# Altium schematic sheet Jumper Matrix.SchDoc: Power Load Jumper Matrix
size Letter; SheetNumber: 9; SheetTotal: 18
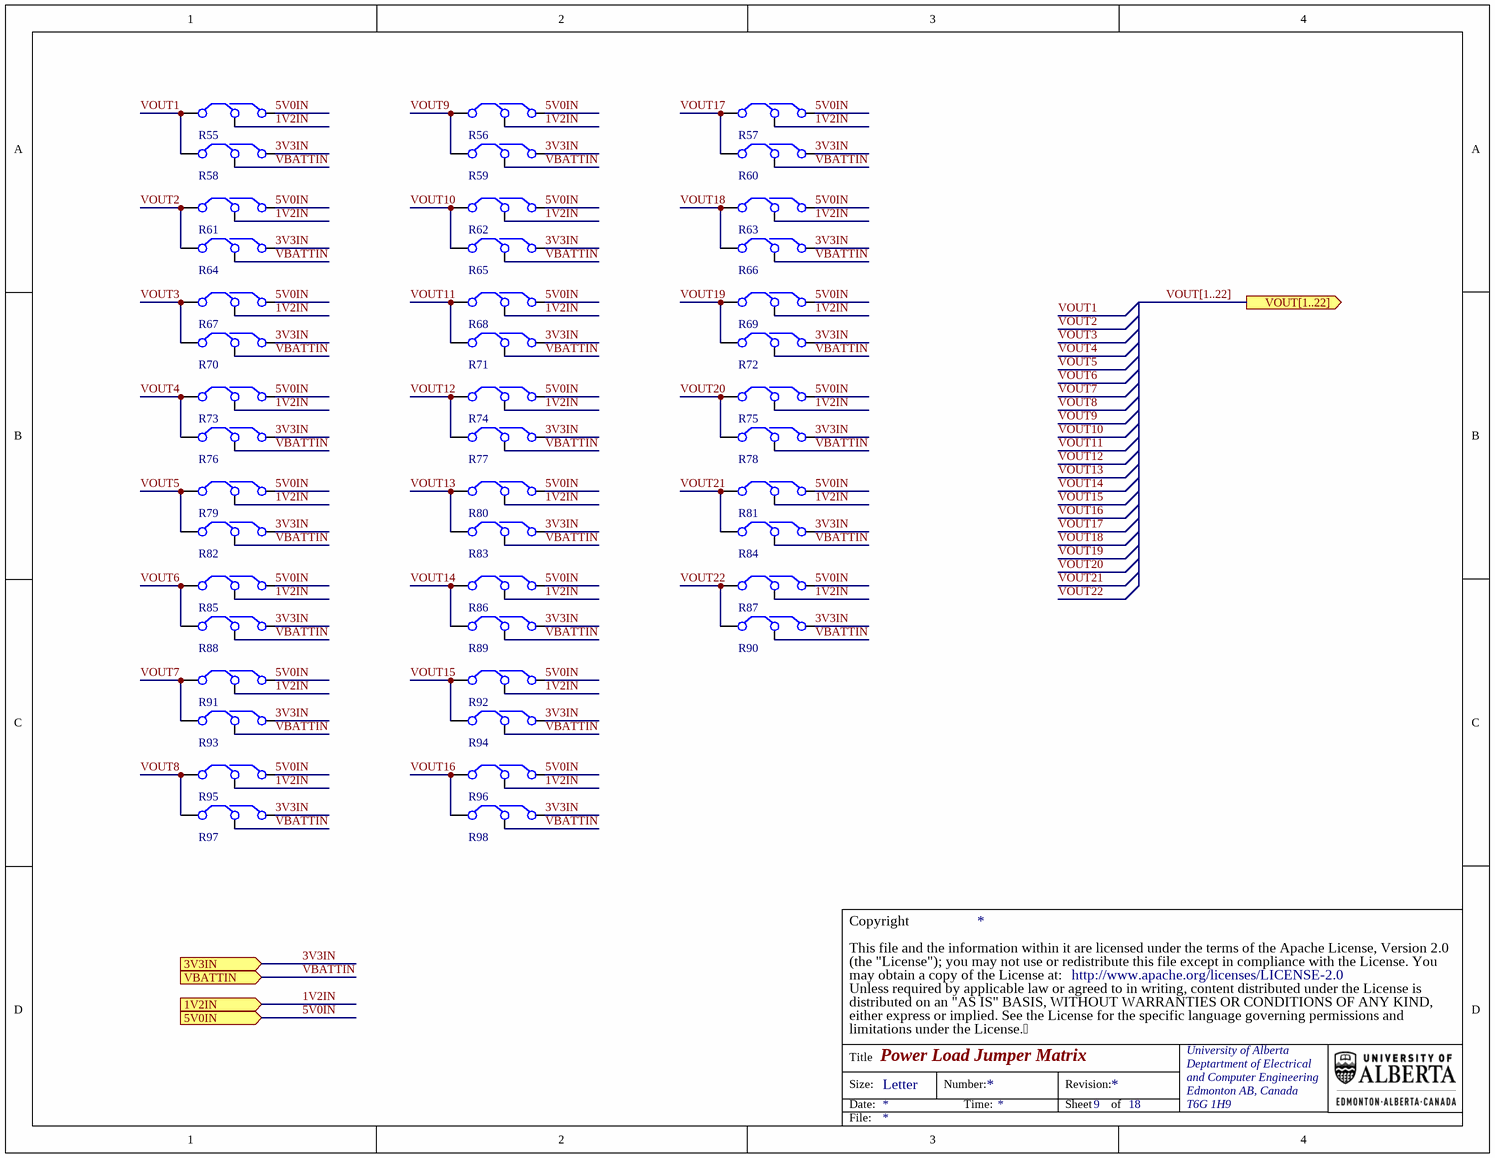
[diagram p0: Jumper Matrix.SchDoc]

## Parts
R55  Jumper  [VSH-RCZ1005orRCZ0505]  (value not drawn)
R56  Jumper  [VSH-RCZ1005orRCZ0505]  (value not drawn)
R57  Jumper  [VSH-RCZ1005orRCZ0505]  (value not drawn)
R58  Jumper  [VSH-RCZ1005orRCZ0505]  (value not drawn)
R59  Jumper  [VSH-RCZ1005orRCZ0505]  (value not drawn)
R60  Jumper  [VSH-RCZ1005orRCZ0505]  (value not drawn)
R61  Jumper  [VSH-RCZ1005orRCZ0505]  (value not drawn)
R62  Jumper  [VSH-RCZ1005orRCZ0505]  (value not drawn)
R63  Jumper  [VSH-RCZ1005orRCZ0505]  (value not drawn)
R64  Jumper  [VSH-RCZ1005orRCZ0505]  (value not drawn)
R65  Jumper  [VSH-RCZ1005orRCZ0505]  (value not drawn)
R66  Jumper  [VSH-RCZ1005orRCZ0505]  (value not drawn)
R67  Jumper  [VSH-RCZ1005orRCZ0505]  (value not drawn)
R68  Jumper  [VSH-RCZ1005orRCZ0505]  (value not drawn)
R69  Jumper  [VSH-RCZ1005orRCZ0505]  (value not drawn)
R70  Jumper  [VSH-RCZ1005orRCZ0505]  (value not drawn)
R71  Jumper  [VSH-RCZ1005orRCZ0505]  (value not drawn)
R72  Jumper  [VSH-RCZ1005orRCZ0505]  (value not drawn)
R73  Jumper  [VSH-RCZ1005orRCZ0505]  (value not drawn)
R74  Jumper  [VSH-RCZ1005orRCZ0505]  (value not drawn)
R75  Jumper  [VSH-RCZ1005orRCZ0505]  (value not drawn)
R76  Jumper  [VSH-RCZ1005orRCZ0505]  (value not drawn)
R77  Jumper  [VSH-RCZ1005orRCZ0505]  (value not drawn)
R78  Jumper  [VSH-RCZ1005orRCZ0505]  (value not drawn)
R79  Jumper  [VSH-RCZ1005orRCZ0505]  (value not drawn)
R80  Jumper  [VSH-RCZ1005orRCZ0505]  (value not drawn)
R81  Jumper  [VSH-RCZ1005orRCZ0505]  (value not drawn)
R82  Jumper  [VSH-RCZ1005orRCZ0505]  (value not drawn)
R83  Jumper  [VSH-RCZ1005orRCZ0505]  (value not drawn)
R84  Jumper  [VSH-RCZ1005orRCZ0505]  (value not drawn)
R85  Jumper  [VSH-RCZ1005orRCZ0505]  (value not drawn)
R86  Jumper  [VSH-RCZ1005orRCZ0505]  (value not drawn)
R87  Jumper  [VSH-RCZ1005orRCZ0505]  (value not drawn)
R88  Jumper  [VSH-RCZ1005orRCZ0505]  (value not drawn)
R89  Jumper  [VSH-RCZ1005orRCZ0505]  (value not drawn)
R90  Jumper  [VSH-RCZ1005orRCZ0505]  (value not drawn)
R91  Jumper  [VSH-RCZ1005orRCZ0505]  (value not drawn)
R92  Jumper  [VSH-RCZ1005orRCZ0505]  (value not drawn)
R93  Jumper  [VSH-RCZ1005orRCZ0505]  (value not drawn)
R94  Jumper  [VSH-RCZ1005orRCZ0505]  (value not drawn)
R95  Jumper  [VSH-RCZ1005orRCZ0505]  (value not drawn)
R96  Jumper  [VSH-RCZ1005orRCZ0505]  (value not drawn)
R97  Jumper  [VSH-RCZ1005orRCZ0505]  (value not drawn)
R98  Jumper  [VSH-RCZ1005orRCZ0505]  (value not drawn)

## Ports
1V2IN (in), 3V3IN (in), 5V0IN (in), VBATTIN (in), VOUT[1..22] (out)

## Nets
1V2IN: R55.2 R56.2 R57.2 R61.2 R62.2 R63.2 R67.2 R68.2 R69.2 R73.2 R74.2 R75.2 R79.2 R80.2 R81.2 R85.2 R86.2 R87.2 R91.2 R92.2 R95.2 R96.2 ; port 1V2IN
3V3IN: R58.3 R59.3 R60.3 R64.3 R65.3 R66.3 R70.3 R71.3 R72.3 R76.3 R77.3 R78.3 R82.3 R83.3 R84.3 R88.3 R89.3 R90.3 R93.3 R94.3 R97.3 R98.3 ; port 3V3IN
5V0IN: R55.3 R56.3 R57.3 R61.3 R62.3 R63.3 R67.3 R68.3 R69.3 R73.3 R74.3 R75.3 R79.3 R80.3 R81.3 R85.3 R86.3 R87.3 R91.3 R92.3 R95.3 R96.3 ; port 5V0IN
VBATTIN: R58.2 R59.2 R60.2 R64.2 R65.2 R66.2 R70.2 R71.2 R72.2 R76.2 R77.2 R78.2 R82.2 R83.2 R84.2 R88.2 R89.2 R90.2 R93.2 R94.2 R97.2 R98.2 ; port VBATTIN
VOUT1: R55.1 R58.1
VOUT2: R61.1 R64.1
VOUT3: R67.1 R70.1
VOUT4: R73.1 R76.1
VOUT5: R79.1 R82.1
VOUT6: R85.1 R88.1
VOUT7: R91.1 R93.1
VOUT8: R95.1 R97.1
VOUT9: R56.1 R59.1
VOUT10: R62.1 R65.1
VOUT11: R68.1 R71.1
VOUT12: R74.1 R77.1
VOUT13: R80.1 R83.1
VOUT14: R86.1 R89.1
VOUT15: R92.1 R94.1
VOUT16: R96.1 R98.1
VOUT17: R57.1 R60.1
VOUT18: R63.1 R66.1
VOUT19: R69.1 R72.1
VOUT20: R75.1 R78.1
VOUT21: R81.1 R84.1
VOUT22: R87.1 R90.1

## Buses and harness runs
bus VOUT[1..22] = port VOUT[1..22]

## Notes on the sheet
- (the "License"); you may not use or redistribute this file except in compliance with the License. You
- This file and the information within it are licensed under the terms of the Apache License, Version 2.0
- Copyright
- Unless required by applicable law or agreed to in writing, content distributed under the License is
- distributed on an "AS IS" BASIS, WITHOUT WARRANTIES OR CONDITIONS OF ANY KIND,
- either express or implied. See the License for the specific language governing permissions and
- limitations under the License.
- may obtain a copy of the License at:
- http://www.apache.org/licenses/LICENSE-2.0
- Title
- Size:
- Date:
- Letter
- Number:
- Time:
- Revision:
- Sheet
- of
- University of Alberta
- Deptartment of Electrical
- and Computer Engineering
- Edmonton AB, Canada
- T6G 1H9
- File:

## Library data of the parts
R55-R98 = PowerRailSelector